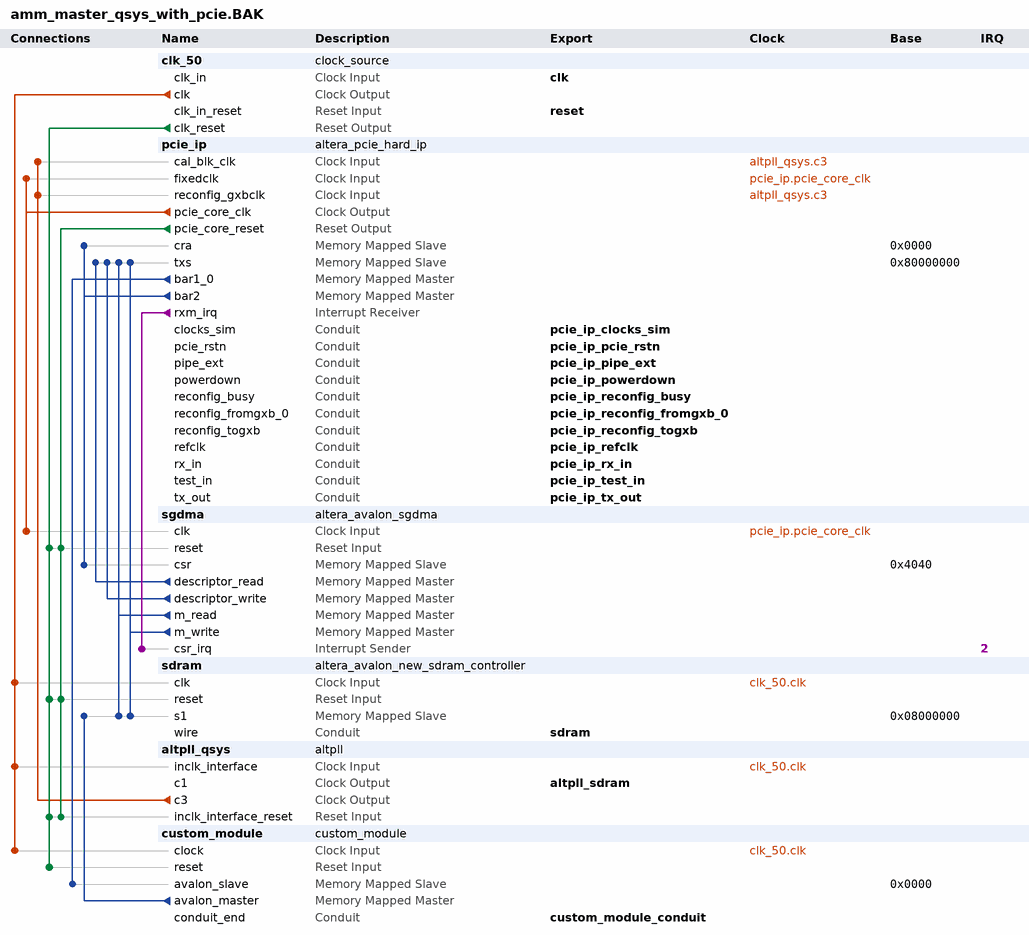
[diagram p0: system contents]
# Platform Designer (Qsys) system amm_master_qsys_with_pcie.BAK, Cyclone IV GX EP4CGX150DF31C7
# Parameters at their usual value, and those the tool derives, are not listed.
package require -exact qsys 13.0
create_system amm_master_qsys_with_pcie.BAK
set_project_property DEVICE_FAMILY {Cyclone IV GX}
set_project_property DEVICE EP4CGX150DF31C7

add_instance clk_50 clock_source 13.0
set_instance_parameter_value clk_50 clockFrequency 50000000

add_instance pcie_ip altera_pcie_hard_ip 13.0
set_instance_parameter_value pcie_ip p_pcie_test_out_width None
set_instance_parameter_value pcie_ip {BAR Type} {64 bit Prefetchable,Not used,32 bit Non-Prefetchable,Not used,Not used,Not used}
set_instance_parameter_value pcie_ip vendor_id 4466
set_instance_parameter_value pcie_ip device_id 57345
set_instance_parameter_value pcie_ip class_code 0
set_instance_parameter_value pcie_ip subsystem_vendor_id 4466
set_instance_parameter_value pcie_ip subsystem_device_id 4
set_instance_parameter_value pcie_ip my_advanced_errors false
set_instance_parameter_value pcie_ip my_enable_ecrc_check false
set_instance_parameter_value pcie_ip my_enable_ecrc_gen false
set_instance_parameter_value pcie_ip CG_NO_CPL_REORDERING 0
set_instance_parameter_value pcie_ip CG_ENABLE_A2P_INTERRUPT 0
set_instance_parameter_value pcie_ip CB_A2P_ADDR_MAP_PASS_THRU_BITS 31
set_instance_parameter_value pcie_ip {PCIe Address 63:32} 0x00000000,0x00000000,0x00000000,0x00000000,0x00000000,0x00000000,0x00000000,0x00000000,0x00000000,0x00000000,0x00000000,0x00000000,0x00000000,0x00000000,0x00000000,0x00000000
set_instance_parameter_value pcie_ip {PCIe Address 31:0} 0x00000000,0x00000000,0x00000000,0x00000000,0x00000000,0x00000000,0x00000000,0x00000000,0x00000000,0x00000000,0x00000000,0x00000000,0x00000000,0x00000000,0x00000000,0x00000000

add_instance sgdma altera_avalon_sgdma 13.0.1.99.2
set_instance_parameter_value sgdma enableBurstTransfers true
set_instance_parameter_value sgdma enableUnalignedTransfers false
set_instance_parameter_value sgdma readBlockDataWidth 64
set_instance_parameter_value sgdma sinkErrorWidth 0
set_instance_parameter_value sgdma sourceErrorWidth 0
set_instance_parameter_value sgdma transferMode MEMORY_TO_MEMORY
set_instance_parameter_value sgdma writeBurstcountWidth 8

add_instance sdram altera_avalon_new_sdram_controller 13.0.1.99.2
set_instance_parameter_value sdram TAC 5.5
set_instance_parameter_value sdram TRCD 20.0
set_instance_parameter_value sdram TRP 20.0
set_instance_parameter_value sdram casLatency 3
set_instance_parameter_value sdram columnWidth 10
set_instance_parameter_value sdram dataWidth 32
set_instance_parameter_value sdram generateSimulationModel false
set_instance_parameter_value sdram model custom
set_instance_parameter_value sdram numberOfBanks 4
set_instance_parameter_value sdram numberOfChipSelects 1
set_instance_parameter_value sdram powerUpDelay 100.0
set_instance_parameter_value sdram refreshPeriod 15.625
set_instance_parameter_value sdram rowWidth 12

add_instance altpll_qsys altpll 13.0
set_instance_parameter_value altpll_qsys INCLK0_INPUT_FREQUENCY 20000
set_instance_parameter_value altpll_qsys CLK0_MULTIPLY_BY 3
set_instance_parameter_value altpll_qsys CLK1_MULTIPLY_BY 3
set_instance_parameter_value altpll_qsys CLK2_MULTIPLY_BY 1
set_instance_parameter_value altpll_qsys CLK3_MULTIPLY_BY 2
set_instance_parameter_value altpll_qsys CLK0_DIVIDE_BY 1
set_instance_parameter_value altpll_qsys CLK1_DIVIDE_BY 1
set_instance_parameter_value altpll_qsys CLK2_DIVIDE_BY 1
set_instance_parameter_value altpll_qsys CLK3_DIVIDE_BY 1
set_instance_parameter_value altpll_qsys CLK1_PHASE_SHIFT -1852
set_instance_parameter_value altpll_qsys CLK2_PHASE_SHIFT 0
set_instance_parameter_value altpll_qsys CLK3_PHASE_SHIFT 0
set_instance_parameter_value altpll_qsys CLK1_DUTY_CYCLE 50
set_instance_parameter_value altpll_qsys CLK2_DUTY_CYCLE 50
set_instance_parameter_value altpll_qsys CLK3_DUTY_CYCLE 50
set_instance_parameter_value altpll_qsys PORT_clk1 PORT_USED
set_instance_parameter_value altpll_qsys PORT_clk2 PORT_USED
set_instance_parameter_value altpll_qsys PORT_clk3 PORT_USED
set_instance_parameter_value altpll_qsys PORT_ARESET PORT_USED
set_instance_parameter_value altpll_qsys PORT_LOCKED PORT_USED

add_instance custom_module custom_module 1.0
set_instance_parameter_value custom_module MASTER_ADDRESSWIDTH 28
set_instance_parameter_value custom_module SLAVE_ADDRESSWIDTH 5
set_instance_parameter_value custom_module DATAWIDTH 32
set_instance_parameter_value custom_module NUMREGS 32
set_instance_parameter_value custom_module REGWIDTH 32

# connections
add_connection altpll_qsys.c3 pcie_ip.cal_blk_clk clock
add_connection altpll_qsys.c3 pcie_ip.reconfig_gxbclk clock
add_connection clk_50.clk altpll_qsys.inclk_interface clock
add_connection clk_50.clk custom_module.clock clock
add_connection clk_50.clk sdram.clk clock
add_connection pcie_ip.pcie_core_clk pcie_ip.fixedclk clock
add_connection pcie_ip.pcie_core_clk sgdma.clk clock
add_connection clk_50.clk_reset altpll_qsys.inclk_interface_reset reset
add_connection clk_50.clk_reset custom_module.reset reset
add_connection clk_50.clk_reset sdram.reset reset
add_connection clk_50.clk_reset sgdma.reset reset
add_connection pcie_ip.pcie_core_reset altpll_qsys.inclk_interface_reset reset
add_connection pcie_ip.pcie_core_reset sdram.reset reset
add_connection pcie_ip.pcie_core_reset sgdma.reset reset
add_connection custom_module.avalon_master sdram.s1 avalon
set_connection_parameter_value custom_module.avalon_master/sdram.s1 baseAddress 0x08000000
add_connection pcie_ip.bar1_0 custom_module.avalon_slave avalon
set_connection_parameter_value pcie_ip.bar1_0/custom_module.avalon_slave baseAddress 0x0000
add_connection pcie_ip.bar2 pcie_ip.cra avalon
set_connection_parameter_value pcie_ip.bar2/pcie_ip.cra baseAddress 0x0000
add_connection pcie_ip.bar2 sgdma.csr avalon
set_connection_parameter_value pcie_ip.bar2/sgdma.csr baseAddress 0x4040
add_connection sgdma.descriptor_read pcie_ip.txs avalon
set_connection_parameter_value sgdma.descriptor_read/pcie_ip.txs baseAddress 0x80000000
add_connection sgdma.descriptor_write pcie_ip.txs avalon
set_connection_parameter_value sgdma.descriptor_write/pcie_ip.txs baseAddress 0x80000000
add_connection sgdma.m_read pcie_ip.txs avalon
set_connection_parameter_value sgdma.m_read/pcie_ip.txs arbitrationPriority 2
set_connection_parameter_value sgdma.m_read/pcie_ip.txs baseAddress 0x80000000
add_connection sgdma.m_read sdram.s1 avalon
set_connection_parameter_value sgdma.m_read/sdram.s1 arbitrationPriority 2
set_connection_parameter_value sgdma.m_read/sdram.s1 baseAddress 0x08000000
add_connection sgdma.m_write pcie_ip.txs avalon
set_connection_parameter_value sgdma.m_write/pcie_ip.txs arbitrationPriority 2
set_connection_parameter_value sgdma.m_write/pcie_ip.txs baseAddress 0x80000000
add_connection sgdma.m_write sdram.s1 avalon
set_connection_parameter_value sgdma.m_write/sdram.s1 arbitrationPriority 2
set_connection_parameter_value sgdma.m_write/sdram.s1 baseAddress 0x08000000
add_connection pcie_ip.rxm_irq sgdma.csr_irq interrupt
set_connection_parameter_value pcie_ip.rxm_irq/sgdma.csr_irq irqNumber 2

# exported interfaces
add_interface clk clock sink
set_interface_property clk EXPORT_OF clk_50.clk_in
add_interface reset reset sink
set_interface_property reset EXPORT_OF clk_50.clk_in_reset
add_interface pcie_ip_reconfig_togxb conduit end
set_interface_property pcie_ip_reconfig_togxb EXPORT_OF pcie_ip.reconfig_togxb
add_interface pcie_ip_refclk conduit end
set_interface_property pcie_ip_refclk EXPORT_OF pcie_ip.refclk
add_interface pcie_ip_test_in conduit end
set_interface_property pcie_ip_test_in EXPORT_OF pcie_ip.test_in
add_interface pcie_ip_pcie_rstn conduit end
set_interface_property pcie_ip_pcie_rstn EXPORT_OF pcie_ip.pcie_rstn
add_interface pcie_ip_clocks_sim conduit end
set_interface_property pcie_ip_clocks_sim EXPORT_OF pcie_ip.clocks_sim
add_interface pcie_ip_reconfig_busy conduit end
set_interface_property pcie_ip_reconfig_busy EXPORT_OF pcie_ip.reconfig_busy
add_interface pcie_ip_pipe_ext conduit end
set_interface_property pcie_ip_pipe_ext EXPORT_OF pcie_ip.pipe_ext
add_interface pcie_ip_rx_in conduit end
set_interface_property pcie_ip_rx_in EXPORT_OF pcie_ip.rx_in
add_interface pcie_ip_tx_out conduit end
set_interface_property pcie_ip_tx_out EXPORT_OF pcie_ip.tx_out
add_interface pcie_ip_reconfig_fromgxb_0 conduit end
set_interface_property pcie_ip_reconfig_fromgxb_0 EXPORT_OF pcie_ip.reconfig_fromgxb_0
add_interface sdram conduit end
set_interface_property sdram EXPORT_OF sdram.wire
add_interface altpll_sdram clock source
set_interface_property altpll_sdram EXPORT_OF altpll_qsys.c1
add_interface pcie_ip_powerdown conduit end
set_interface_property pcie_ip_powerdown EXPORT_OF pcie_ip.powerdown
add_interface custom_module_conduit conduit end
set_interface_property custom_module_conduit EXPORT_OF custom_module.conduit_end

set_interconnect_requirement {$system} qsys_mm.clockCrossingAdapter HANDSHAKE
set_interconnect_requirement {$system} qsys_mm.maxAdditionalLatency 1

save_system amm_master_qsys_with_pcie.BAK.qsys
